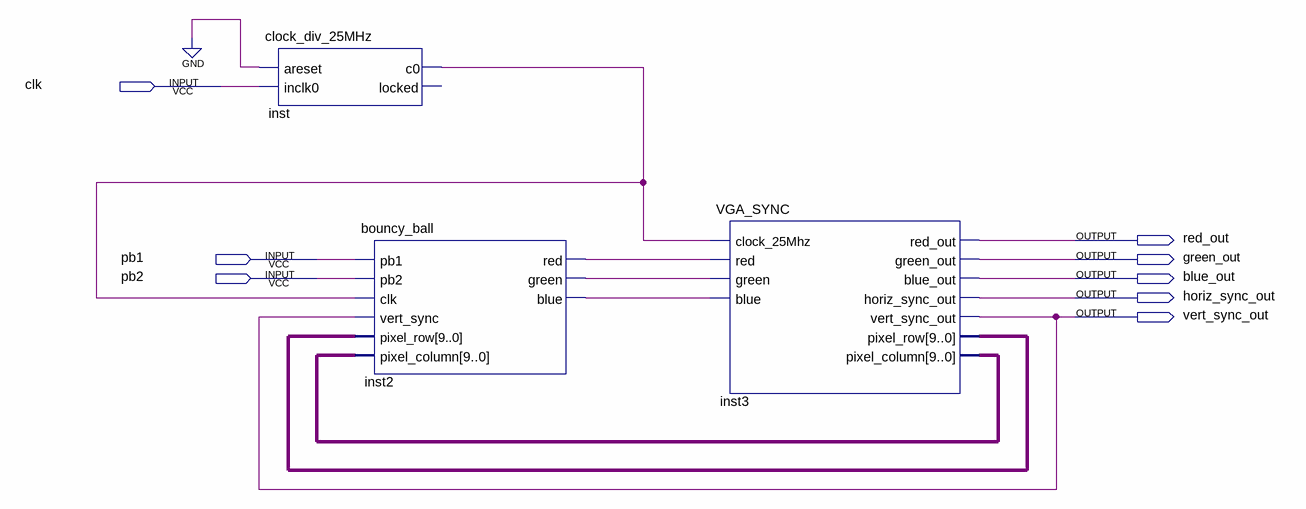
[diagram p0: schematic sheet]
// Quartus schematic Test_BouncyBall.bdf as structural Verilog: 3 symbols, 8 pins
module Test_BouncyBall (
  input  clk,
  input  pb1,
  input  pb2,
  output red_out,
  output green_out,
  output blue_out,
  output horiz_sync_out,
  output vert_sync_out
);

  wire inst2_blue, inst2_green, inst2_red, inst_c0;
  wire [9:0] inst3_pixel_column, inst3_pixel_row;

  clock_div_25MHz inst (.areset(1'b0), .inclk0(clk), .c0(inst_c0));  // open: locked
  bouncy_ball inst2 (
    .pb1(pb1), .pb2(pb2), .clk(inst_c0), .vert_sync(vert_sync_out), .pixel_row(inst3_pixel_row),
    .pixel_column(inst3_pixel_column), .red(inst2_red), .green(inst2_green), .blue(inst2_blue));
  VGA_SYNC inst3 (
    .clock_25Mhz(inst_c0), .red(inst2_red), .green(inst2_green), .blue(inst2_blue), .red_out(red_out),
    .green_out(green_out), .blue_out(blue_out), .horiz_sync_out(horiz_sync_out),
    .vert_sync_out(vert_sync_out), .pixel_row(inst3_pixel_row), .pixel_column(inst3_pixel_column));
endmodule
